# Altium schematic sheet Лист 1.SchDoc
size 420 x 297 mm; Address1: Address1; Address2: Address2; Address3: Address3; Address4: Address4; DocumentNumber: АБВГ.123456.001 Э3; SheetNumber: 1; Scale: 1:1; DocumentType: Схема электрическая принципиальная; FirstReferrence: АБВГ.123456.001; Разраб.: Иванов; Обозначение документа: АБВГ.123456.001 Э3; Пров.: Петров; Утв.: Сидоров; Номер листа: 1; Общее количество листов: 1; Масштаб: 1:1; Наименование организации: ОАО "Ваша фирма"; Перв. применение: АБВГ.123456.000; Наименование изделия 3: Схема электрическая принципиальная; Нач. отд.: Нач. отд.; Фамилия нач. отд.: Сидоров
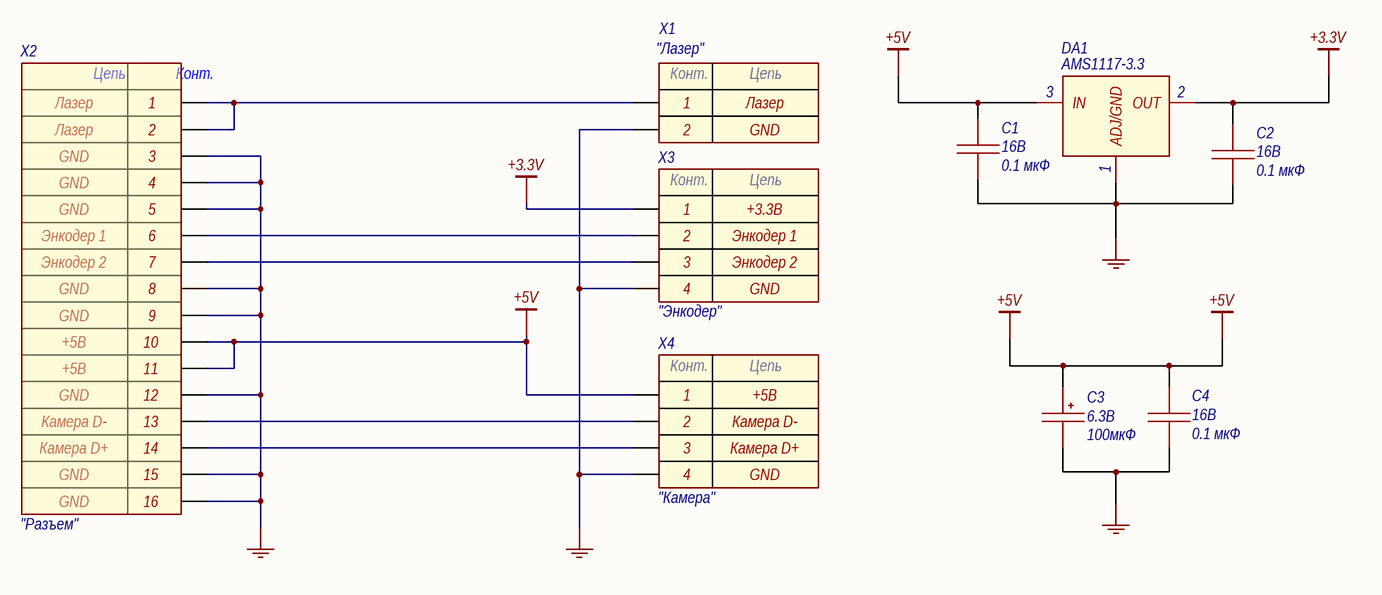
[diagram p0: Лист 1.SchDoc]

## Parts
C1  value 0.1 мкФ  Voltage: 16В  [CAP: 0805]
C2  value 0.1 мкФ  Voltage: 16В  [CAP: 0805]
C3  value 100мкФ  Voltage: 6.3В  [CAP: TANTAL-A]
C4  value 0.1 мкФ  Voltage: 16В  [CAP: 0805]
DA1  AMS1117-3.3  [SOT223 AMS1117]
X1  CommentText: "Лазер"  [CON: CWF-2]
X2  "Разъем"  [CON: 52207-1633, FFC / FPC]
X3  CommentText: "Энкодер"  [CON: CWF-4]
X4  CommentText: "Камера"  [CON: CWF-4]

## Nets
+3.3V: C2.2 DA1.2(OUT) X3.1
+5V: C1.2 C3.1 C4.2 DA1.3(IN) X2.10 X2.11 X4.1
GND: C1.1 C2.1 C3.2 C4.1 DA1.1(ADJ/GND) X1.2 X2.3 X2.4 X2.5 X2.8 X2.9 X2.12 X2.15 X2.16 X3.4 X4.4
NetX1_1: X1.1 X2.1 X2.2
NetX2_6: X2.6 X3.2
NetX2_7: X2.7 X3.3
NetX2_13: X2.13 X4.2
NetX2_14: X2.14 X4.3

## Notes on the sheet
- Перв. примен.
- Справ. №
- Подп. и дата
- Инв. № дубл.
- Взам. инв. №
- Разраб.
- Изм.
- Лист
- № докум.
- Подп.
- Дата
- Лит.
- Масса
- Масштаб
- Пров.
- Т.контр.
- Листов
- Инв. № подл.
- Утв.
- Н.контр.
- Копировал
- Формат А3
- (in symbol 52207-1633, FFC / FPC) Цепь; Конт.
- (in symbol CWF-2R(CWF-2)) Конт.; Цепь
- (in symbol CWF-4R(CWF-4)) Конт.; Цепь

## Library data of the parts
C1 C2 C4 = Ceramic_0805: Manufacturer: Yageo; PartNumber: CC0805KRX7R7BB104; ValueManufacturerPartNumber: Ceramic capacitor, 0.1 мкФ, X7R, ±10%, 16В, 0805, -55...+125°C; TypeCapacitor: Ceramic capacitor; Tolerance: ±10%; TypeDielectric: X7R; Package: 0805; HelpURL: https://www.digikey.com/product-detail/en/yageo/CC0805KRX7R7BB104/311-1142-1-ND/303052; Temperature: -55...+125°C
C3 = Tantal_A: Manufacturer: AVX; PartNumber: F930J107KAAAJ6; ValueManufacturerPartNumber: Tantalum capacitor, 100мкФ, 6.3В, ±10%, 2Ohm, case A (3216), -55...+125°C; Impedance: 2Ohm; Tolerance: ±10%; TypeDielectric: X7R; TypeCapacitor: Tantalum capacitor; Package: case A (3216); HelpURL: https://www.digikey.com/product-detail/en/avx-corporation/F930J107KAAAJ6/478-12404-1-ND/9645231; Temperature: -55...+125°C
DA1 = AMS1117
X1 = CWF-2R(CWF-2): Manufacturer: Connfly; ValueManufacturerPartNumber: Connector, 2pin, 2.54mm, 250VAC, 3A; PartNumber: CWF-2R; TypeConnector: Connector; VoltageMax: 250VAC; Pitch: 2.54mm; CurrentMax: 3A; Multichannel: 2pin; Pin1: Лазер; Pin2: GND; HelpURL: https://www.chipdip.ru/product/cwf-2r-ds1069-2-mr
X2 = 52207-1633, FFC / FPC: Pin_1: Лазер; Pin_3: GND; Pin_6: Энкодер 1; Pin_7: Энкодер 2; Pin_10: +5В; Pin_13: Камера D-; Pin_14: Камера D+; Pin_2: Лазер; Pin_4: GND; Pin_5: GND; Pin_8: GND; Pin_9: GND; Pin_11: +5В; Pin_12: GND; Pin_15: GND; Pin_16: GND
X3 = CWF-4R(CWF-4): Manufacturer: Connfly; ValueManufacturerPartNumber: Connector, 4pin, 2.54mm, 250VAC, 3A; PartNumber: CWF-4R; TypeConnector: Connector; VoltageMax: 250VAC; Pitch: 2.54mm; Multichannel: 4pin; CurrentMax: 3A; Pin1: +3.3В; Pin2: Энкодер 1; Pin3: Энкодер 2; Pin4: GND; HelpURL: https://www.chipdip.ru/product/cwf-4r-ds1069-4-mr
X4 = CWF-4R(CWF-4): Manufacturer: Connfly; ValueManufacturerPartNumber: Connector, 4pin, 2.54mm, 250VAC, 3A; PartNumber: CWF-4R; TypeConnector: Connector; VoltageMax: 250VAC; Pitch: 2.54mm; Multichannel: 4pin; CurrentMax: 3A; Pin1: +5В; Pin2: Камера D-; Pin3: Камера D+; Pin4: GND; HelpURL: https://www.chipdip.ru/product/cwf-4r-ds1069-4-mr